# Altium schematic sheet Airplane_Navigation_&_Telemetry_Schematic.SchDoc
size A4; SheetNumber: 1; SheetTotal: 3
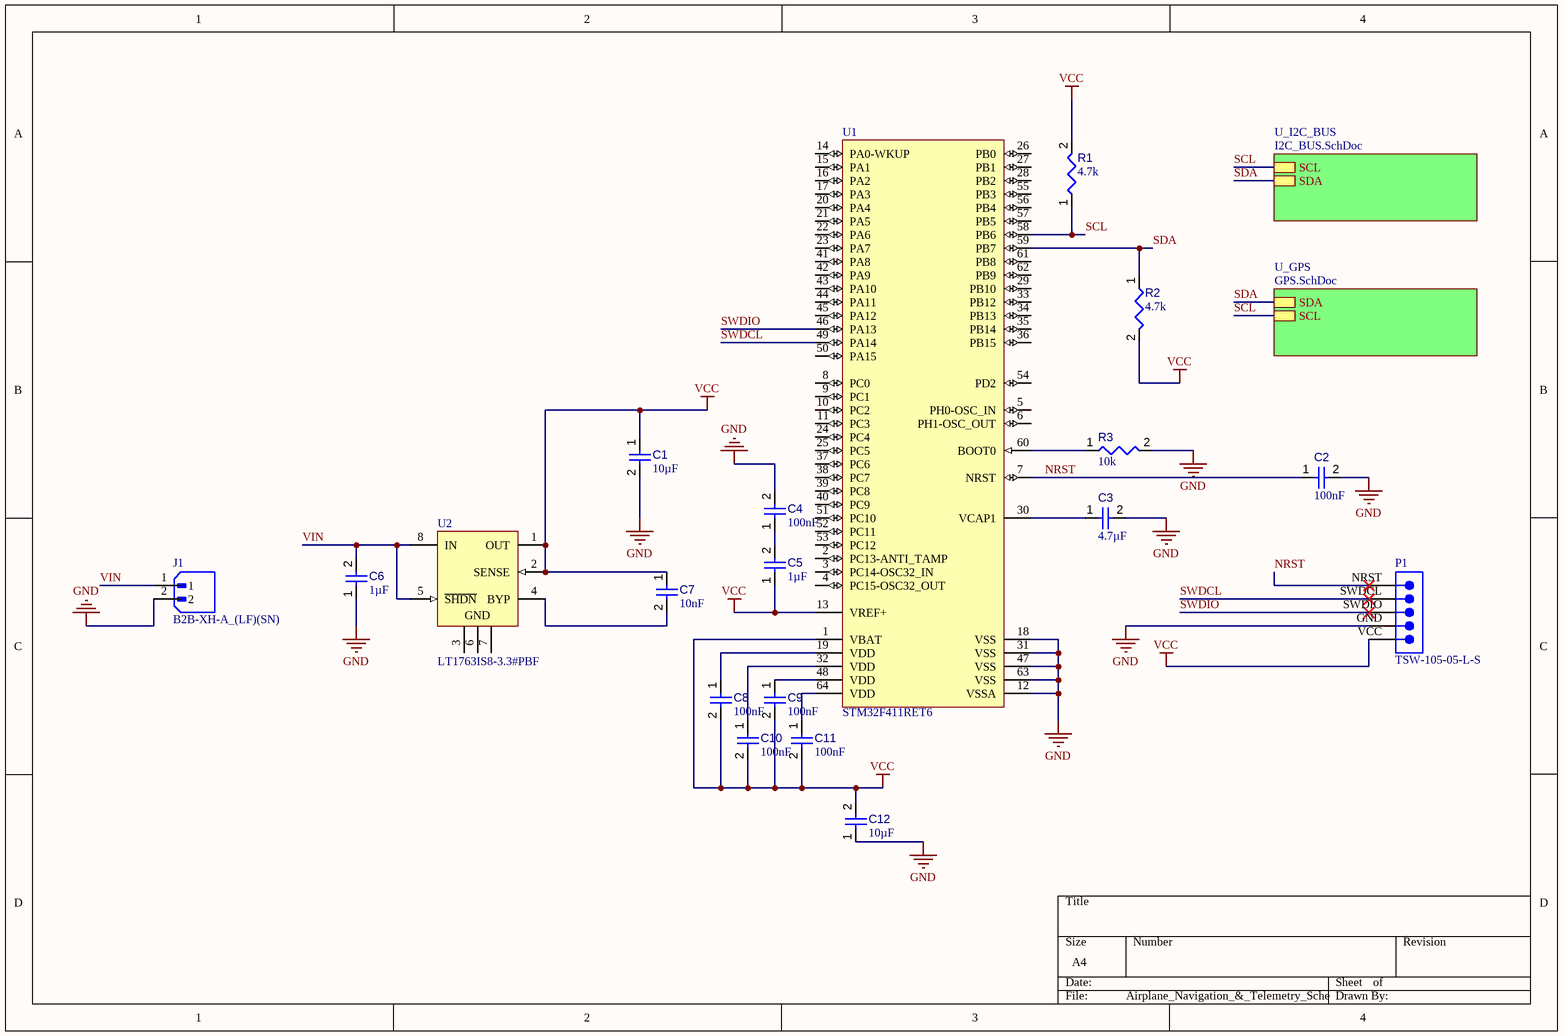
[diagram p0: Airplane_Navigation_&_Telemetry_Schematic.SchDoc]

## Parts
C1  value 10µF  [CAPC0805(2012)145_L]  (hidden comment: Capacitor 10µF +/-20% 25V 0805)
C2  value 100nF  [CAPC1608X90X40NL10T20]  (hidden comment: Capacitor 100 nF +/-10% 50 V 0603)
C3  value 4.7µF  [CAPC0603(1608)100_L]  (hidden comment: Capacitor 4.7µF +/-20% 10V 0603)
C4  value 100nF  [CAPC1608X90X40NL10T20]  (hidden comment: Capacitor 100 nF +/-10% 50 V 0603)
C5  value 1µF  [CAPC1608X90X35ML15T15]  (hidden comment: Capacitor 1uF +/- 10% 16V 0603)
C6  value 1µF  [CAPC1608X90X35ML15T15]  (hidden comment: Capacitor 1uF +/- 10% 16V 0603)
C7  value 10nF  [CAPC0402(1005)60_L]  (hidden comment: Capacitor 10nF +/-20% 50V 0402)
C8  value 100nF  [CAPC1608X90X40NL10T20]  (hidden comment: Capacitor 100 nF +/-10% 50 V 0603)
C9  value 100nF  [CAPC1608X90X40NL10T20]  (hidden comment: Capacitor 100 nF +/-10% 50 V 0603)
C10  value 100nF  [CAPC1608X90X40NL10T20]  (hidden comment: Capacitor 100 nF +/-10% 50 V 0603)
C11  value 100nF  [CAPC1608X90X40NL10T20]  (hidden comment: Capacitor 100 nF +/-10% 50 V 0603)
C12  value 10µF  [CAPC2013X135X45NL10T25]  (hidden comment: Capacitor 10 uF +/- 10% 16 V 0805)
J1  B2B-XH-A_(LF)(SN)  [JST_B2B-XH-A_(LF)(SN)]
P1  TSW-105-05-L-S  [SMTC-TSW-105-05-X-S]
R1  value 4.7k  [RESC0402(1005)_L]  (hidden comment: Resistor 4K7  +/-1 % 0402 63 mW)
R2  value 4.7k  [RESC0402(1005)_L]  (hidden comment: Resistor 4K7  +/-1 % 0402 63 mW)
R3  value 10k  [RESC1005X40X25ML05T05]  (hidden comment: Resistor 10k +/-1% 0402 100 mW)
U1  STM32F411RET6  [STM-LQFP64_L]
U2  LT1763IS8-3.3#PBF  [LT-S8-8_N]

## Sub-sheets
U_GPS = GPS.SchDoc: SDA, SCL
U_I2C_BUS = I2C_BUS.SchDoc: SCL, SDA

## Nets
GND: C1.2 C2.2 C3.2 C4.2 C6.1 C12.1 J1.2 P1.GND R3.2 U1.12(VSSA) U1.18(VSS) U1.31(VSS) U1.47(VSS) U1.63(VSS)
VCC: C1.1 C5.1 C7.1 C8.2 C9.2 C10.2 C11.2 C12.2 P1.VCC R1.2 R2.2 U1.1(VBAT) U1.13(VREF+) U2.1(OUT) U2.2(SENSE)
NRST: C2.1 P1.NRST U1.7(NRST)
SCL: R1.1 U1.58(PB6) ; sheet U_GPS/SCL, sheet U_I2C_BUS/SCL
SDA: R2.1 U1.59(PB7) ; sheet U_GPS/SDA, sheet U_I2C_BUS/SDA
SWDCL: P1.SWDCL U1.49(PA14)
SWDIO: P1.SWDIO U1.46(PA13)
VIN: C6.2 J1.1 U2.5(~{SHDN}) U2.8(IN)
NetC3_1: C3.1 U1.30(VCAP1)
NetC4_1: C4.1 C5.2
NetC7_2: C7.2 U2.4(BYP)
NetC8_1: C8.1 U1.19(VDD)
NetC9_1: C9.1 U1.48(VDD)
NetC10_1: C10.1 U1.32(VDD)
NetC11_1: C11.1 U1.64(VDD)
NetR3_1: R3.1 U1.60(BOOT0)

Not connected (* = marked no-connect by the designer): U1 2(PC13-ANTI_TAMP) 3(PC14-OSC32_IN) 4(PC15-OSC32_OUT) 5(PH0-OSC_IN) 6(PH1-OSC_OUT) 8(PC0) 9(PC1) 10(PC2) 11(PC3) 14(PA0-WKUP) 15(PA1) 16(PA2) 17(PA3) 20(PA4) 21(PA5) 22(PA6) 23(PA7) 24(PC4) 25(PC5) 26(PB0) 27(PB1) 28(PB2) 29(PB10) 33(PB12) 34(PB13) 35(PB14) 36(PB15) 37(PC6) 38(PC7) 39(PC8) 40(PC9) 41(PA8) 42(PA9) 43(PA10) 44(PA11) 45(PA12) 50(PA15) 51(PC10) 52(PC11) 53(PC12) 54(PD2) 55(PB3) 56(PB4) 57(PB5) 61(PB8) 62(PB9); U2 3(GND) 6(GND) 7(GND)

## Library data of the parts
C1 = CMP-001-00079-4: Chip Capacitor, 10µF +/-20%, 25V, 0805, Thickness 1.45 mm; Tolerance: 10%; Max Operating Temperature: 85°C; Case/Package: 0805; Voltage Rating: 25V; Min Operating Temperature: -55°C; Mounting Technology: SMT; Pins: 2
C2 C4 C8-C11 = CMP-001-00017-6: Chip Capacitor, 100 nF, +/- 10%, 50 V, 0603 (1608 Metric); Voltage Rating: 50V; Capacitor Type: Ceramic; Tolerance: 10%; Mounting Technology: SM; Max Operating Temperature: 125°C; RoHS Compliant: True; Pins: 2; Case/Package: 0603; Min Operating Temperature: -55°C
C3 = CMP-001-00076-4: Chip Capacitor, 4.7µF +/-20%, 10V, 0603, Thickness 1 mm; Tolerance: 10%; Mounting Technology: SMT; Case/Package: 0603; Pins: 2; Min Operating Temperature: -55°C; Max Operating Temperature: 85°C; Voltage Rating: 10V
C5 C6 = CMP-001-00004-6: Chip Capacitor, 1 uF, +/- 10%, 16 V, 0603 (1608 Metric); Capacitor Type: Ceramic; Mounting Technology: SM; RoHS Compliant: True; Min Operating Temperature: -55°C; Case/Package: 0603; Pins: 2; Voltage Rating: 16V; Max Operating Temperature: 125°C; Tolerance: 10%
C7 = CMP-001-00069-3: Chip Capacitor, 10nF +/-20%, 50V, 0402, Thickness 0.6 mm; Tolerance: 5%; Max Operating Temperature: 85°C; Pins: 2; Case/Package: 0402; Voltage Rating: 50V; Min Operating Temperature: -55°C; Mounting Technology: SMT
C12 = CMP-001-00015-6: Chip Capacitor, 10 uF, +/- 10%, 16 V, 0805 (2012 Metric); Voltage Rating: 16V; Capacitor Type: Ceramic; RoHS Compliant: True; Max Operating Temperature: 85°C; Min Operating Temperature: -55°C; Mounting Technology: SM; Tolerance: 10%; Case/Package: 0805; Pins: 2
J1 = CMP-002-00072-1: Connector Header Through Hole 2 position 0.098 (2.50mm); MP: B2B-XH-A (LF)(SN); MF: JST Sales; Pins: 2; Value: *; Check_prices: https://www.snapeda.com/parts/B2B-XH-A%20(LF)(SN)/JST+Sales+America+Inc./view-part/?ref=eda; Case/Package: None; Design Item ID: B2B-XH-A_(LF)(SN); Component Type: Standard; SnapEDA_Link: https://www.snapeda.com/parts/B2B-XH-A%20(LF)(SN)/JST+Sales+America+Inc./view-part/?ref=snap; Source: B2B-XH-A_(LF)(SN).SchLib
P1 = CMP-1024-00366-1: 0.025" SQ Post Header, Through-hole, Vertical, -55 to 125 degC, 2.54 mm Pitch, 5-Pin, Male, RoHS; Manufacturer: Samtec; Pitch: 2.54 mm; PackageVersion: DM, 8/1988; PartNumber: TSW-105-05-L-S; Orientation: Vertical; Temperature Range: -55 to 125 degC; ComponentLink1Description: Manufacturer URL; PackageDescription: .025[0.64] SQ. Post Terminal Strip Assembly; ComponentLink2URL: http://www.samtec.com/documents/webfiles/pdf/TSW_TH.PDF; PackageReference: TSW-105-05-X-S; ComponentLink2Description: Datasheet; Mounting Technology: Through-hole; DatasheetVersion: F-214; ComponentLink1URL: http://www.samtec.com; RoHS: True; ComponentLink3URL: http://www.samtec.com/documents/webfiles/cpdf/TSW-XXX-XX-XXX-X-XX-XXX-MKT.pdf; ComponentLink3Description: Package Specification
R1 R2 = CMP-009-00158-3: Chip Resistor, 4,7 kOhms, +/-1 %, 63 mW, -55 to 155 degC, 0402; Power: 63mW; Tolerance: 1%; Max Operating Temperature: 155°C; Pins: 2; Min Operating Temperature: -55°C; Case/Package: 0402
R3 = CMP-009-00015-5: Chip Resistor, 10 KOhm, +/- 1%, 0.1 W, -55 to 155 degC, 0402 (1005 Metric); Voltage Rating: 50V; Power: 100mW; Case/Package: 0402; RoHS Compliant: True; Min Operating Temperature: -55°C; Mounting Technology: SM; Tolerance: 1%; Max Operating Temperature: 155°C; Pins: 2
U1 = CMP-0243-00169-1: ARM Cortex-M4 32-bit MCU+FPU, 512 KB Flash, 128 KB RAM, 50 I/Os, 64-Pin LQFP, -40 to 85 degC, Tray; Operating Frequency(F) (Processor speed) (MHz): 100; FLASH Size (Prog) (kB): 512; Supply Voltage(Vcc) min (V): 1.7; Internal RAM Size (kB): 128; I/Os (High Current): 50; Packing: Tray; ComponentLink1Description: Manufacturer URL; Package Description: LQFP64; DatasheetVersion: Rev. 6; Mounting Technology: Surface Mount; Package Reference: 64-Pin Low-profile Quad Flat Package, Body 10 x 10 mm, Pitch 0.5 mm; ComponentLink2Description: Datasheet; Core: ARM Cortex-M4; ComponentLink2URL: http://www.st.com/st-web-ui/static/active/en/resource/technical/document/datasheet/DM00115249.pdf; ComponentLink1URL: http://www.st.com/
U2 = CMP-0476-01566-1: 500 mA, Low Noise, LDO Micropower Regulator, 1.8 to 20 V Vin, 3.3 V Vout, 8-pin SOIC (S8-8), -40 to 125 degC, Pb-Free; Manufacturer: Linear Technology; Shutdown Current(uA): 1; Vin Min(V): 1.8; Iout(mA): 500; Noise(uV): 20; Isupply(mA): 0.03; Discrete Pass Element: no; PSRR(dB): 65; Output Voltage: 3.3 V; Dropout Voltage(V): 0.3; ComponentLink3URL: http://cds.linear.com/docs/en/packaging/05081610_G_SO8.pdf; Number of Outputs: 1; ComponentLink2URL: http://cds.linear.com/docs/en/datasheet/1763fg.pdf; ComponentLink1Description: Manufacturer URL; PackageReference: S8-8; DatasheetVersion: Rev. G; ComponentLink3Description: Package Specification; ComponentLink2Description: Datasheet; Mounting Technology: Surface Mount; Vin Max(V): 20; ComponentLink1URL: http://www.linear.com/; PackageDescription: 8-Pin Plastic Small Outline (Narrow .150 Inch), Body 4.9 x 3.9 mm, Pitch 1.27 mm; PartNumber: LT1763IS8-3.3#PBF; RoHS: TRUE; PackageVersion: Rev. G, 03/2012